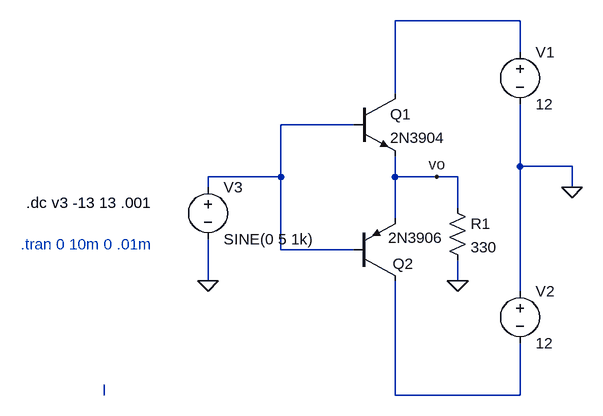
[diagram p0: schematic teoria2.asc]
teoria2.asc, the LTspice schematic file:
Version 4
SHEET 1 880 680
WIRE 448 -32 256 -32
WIRE 448 16 448 -32
WIRE 256 80 256 -32
WIRE 192 128 80 128
WIRE 448 192 448 96
WIRE 528 192 448 192
WIRE 80 208 80 128
WIRE 80 208 -32 208
WIRE 256 208 256 176
WIRE 320 208 256 208
WIRE 352 208 320 208
WIRE -32 224 -32 208
WIRE 528 224 528 192
WIRE 352 256 352 208
WIRE 256 272 256 208
WIRE 80 320 80 208
WIRE 192 320 80 320
WIRE -32 368 -32 304
WIRE 352 368 352 336
WIRE 448 384 448 192
WIRE -192 544 -192 528
WIRE 256 544 256 368
WIRE 448 544 448 464
WIRE 448 544 256 544
FLAG 352 368 0
FLAG 528 224 0
FLAG 320 208 vo
FLAG -32 368 0
SYMBOL npn 192 80 R0
SYMATTR InstName Q1
SYMATTR Value 2N3904
SYMBOL pnp 192 368 M180
WINDOW 0 60 26 Left 2
WINDOW 3 53 66 Left 2
SYMATTR InstName Q2
SYMATTR Value 2N3906
SYMBOL voltage 448 0 R0
WINDOW 123 0 0 Left 0
WINDOW 39 0 0 Left 0
SYMATTR InstName V1
SYMATTR Value 12
SYMBOL voltage 448 368 R0
WINDOW 123 0 0 Left 0
WINDOW 39 0 0 Left 0
SYMATTR InstName V2
SYMATTR Value 12
SYMBOL res 336 240 R0
SYMATTR InstName R1
SYMATTR Value 330
SYMBOL voltage -32 208 R0
WINDOW 123 0 0 Left 0
WINDOW 39 0 0 Left 0
SYMATTR InstName V3
SYMATTR Value SINE(0 5 1k)
TEXT -312 248 Left 2 !.dc v3 -13 13 .001
TEXT -320 312 Left 2 ;.tran 0 10m 0 .01m

The netlist it stands for:
* teoria2.asc
Q1 N001 N002 vo 0 2N3904
Q2 N004 N002 vo 0 2N3906
V1 N001 0 12
V2 0 N004 12
R1 vo 0 330
V3 N002 0 SINE(0 5 1k)
.model NPN NPN
.model PNP PNP
.lib standard.bjt
.dc v3 -13 13 .001
* .tran 0 10m 0 .01m
.backanno
.end